# Altium project 频率PWM控制均可调模块.PrjPCB
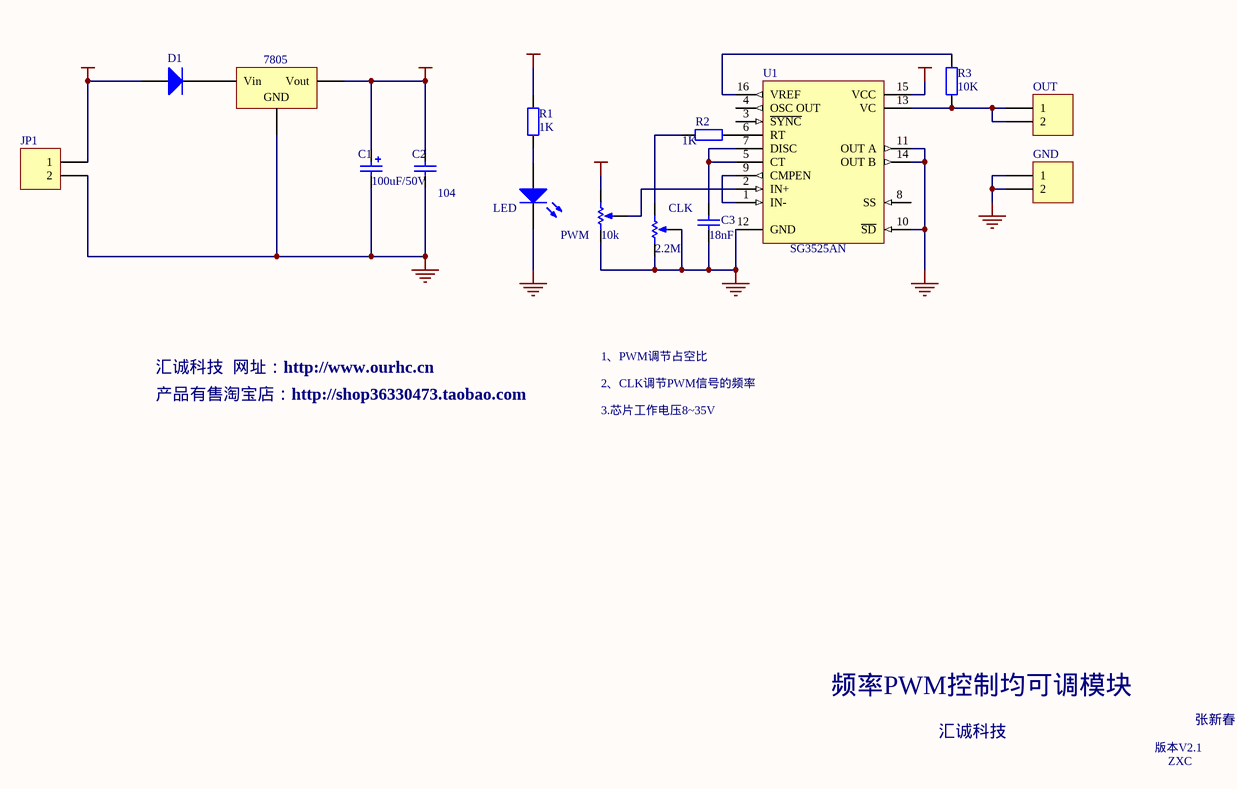
[diagram p0: 频率PWM控制均可调模块.SchDoc]
1 sheet, 15 parts. Net scope: global (net labels, ports and power ports of the same name join across sheets).
Board file: 频率PWM控制均可调模块.PcbDoc

## Sheet 频率PWM控制均可调模块.SchDoc
size A4

### Parts
7805  SDWYG  [WYG]  (value not drawn)
C1  value 100uF/50V  [C-DJ-6]  (hidden comment: DJDR)
C2  value 104  [CPDR]  (hidden comment: CPDR)
C3  value 18nF  [CPDR]  (hidden comment: Cap Semi)
CLK  value 2.2M  [SIP3-D]  (hidden comment: RPot)
D1  Diode 1N4007  [D-ZL-10]  (value not drawn)
GND  Header 2  [HDR1X2]  (value not drawn)
JP1  PZ_2  [JK128_2]  (value not drawn)
LED  LED2  [LED_D]  (value not drawn)
OUT  Header 2  [HDR1X2]  (value not drawn)
PWM  value 10k  [SIP3-D]  (hidden comment: RPot)
R1  value 1K  [AXIAL-0.4]  (hidden comment: Res2)
R2  value 1K  [AXIAL-0.4]  (hidden comment: Res2)
R3  value 10K  [AXIAL-0.4]  (hidden comment: Res2)
U1  SG3525AN  [DIP16]

### Nets
GND: 7805.3(GND) C1.2 C2.1 C3.2 CLK.1(TOP) CLK.3(TAP) GND.1 GND.2 JP1.2 LED.2(K) PWM.1(TOP) U1.10(~{SD}) U1.11(OUT_A) U1.12(GND) U1.14(OUT_B)
VCC1: D1.1(A) JP1.1 U1.15(VCC)
VCC2: 7805.2(Vout) C1.1 C2.2 PWM.2(BOT) R1.1
Net7805_1: 7805.1(Vin) D1.2(K)
NetC3_1: C3.1 U1.5(CT) U1.7(DISC)
NetCLK_2: CLK.2(BOT) R2.2
NetLED_1: LED.1(A) R1.2
NetOUT_1: OUT.1 OUT.2 R3.1 U1.13(VC)
NetPWM_3: PWM.3(TAP) U1.2(IN+)
NetR2_1: R2.1 U1.6(RT)
NetR3_2: R3.2 U1.16(VREF)
NetU1_1: U1.1(IN-) U1.9(CMPEN)

Not connected (* = marked no-connect by the designer): U1 3(~{SYNC}) 4(OSC_OUT) 8(SS)

### Notes on the sheet
- 汇诚科技  网址：http://www.ourhc.cn
- 产品有售淘宝店：http://shop36330473.taobao.com
- 1、PWM调节占空比
- 2、CLK调节PWM信号的频率
- 3.芯片工作电压8~35V
- 频率PWM控制均可调模块
- 汇诚科技
- 版本V2.1
- 张新春
- ZXC

### Library data of the parts
7805 = SDWYG: 三端稳压器; Published: 24-Mar-1999; LatestRevisionDate: 17-Jul-2002; LatestRevisionNote: Re-released for DXP Platform.; Publisher: Altium Limited; Code_JEDEC: SMD-220
C1 = DJDR: 电解电容; Published: 8-Jun-2000; LatestRevisionDate: 17-Jul-2002; LatestRevisionNote: Re-released for DXP Platform.; Publisher: Altium Limited
C2 = CPDR: 瓷片电容; Published: 8-Jun-2000; LatestRevisionDate: 17-Jul-2002; LatestRevisionNote: Re-released for DXP Platform.; Publisher: Altium Limited
C3 = Cap Semi: Capacitor (Semiconductor SIM Model); Published: 8-Jun-2000; LatestRevisionDate: 17-Jul-2002; LatestRevisionNote: Re-released for DXP Platform.; PackageReference: C1206; Publisher: Altium Limited
CLK PWM = RPot: Potentiometer; Sim Note: Enter the Resistance value and the set point into parameter fields.; Set Position: 0.5; Published: 8-Jun-2000; LatestRevisionDate: 17-Jul-2002; LatestRevisionNote: Re-released for DXP Platform.; Publisher: Altium Limited
D1 = Diode 1N4007: 1 Amp General Purpose Rectifier; Published: 8-Jun-2000; LatestRevisionDate: 17-Jul-2002; LatestRevisionNote: Re-released for DXP Platform.; DatasheetDocument: 1998; PackageDocument: Aug-1999; PackageReference: DO-41; Publisher: Altium Limited; Code_JEDEC: DO-204-AL
GND OUT = Header 2: Header, 2-Pin; LatestRevisionDate: 17-Jul-2002; LatestRevisionNote: Re-released for DXP Platform.; Publisher: Altium Limited
JP1 = PZ_2: 排针——2; LatestRevisionDate: 17-Jul-2002; LatestRevisionNote: Re-released for DXP Platform.; Publisher: Altium Limited
LED = LED2: Typical RED, GREEN, YELLOW, AMBER GaAs LED; Published: 8-Jun-2000; LatestRevisionDate: 17-Jul-2002; LatestRevisionNote: Re-released for DXP Platform.; Publisher: Altium Limited
R1-R3 = Res2: Resistor; Published: 8-Jun-2000; LatestRevisionDate: 17-Jul-2002; LatestRevisionNote: Re-released for DXP Platform.; Publisher: Altium Limited
U1 = SG3525AN: Pulse Width Modulator Control Circuit; Published: 15-Apr-2002; DatasheetDocument: 1996; PackageDocument: Apr-2000; PackageReference: 648-08; Publisher: Altium Limited; Code_JEDEC: MS-001-BB